# Altium schematic sheet 03-DC_DC.SchDoc
size A3
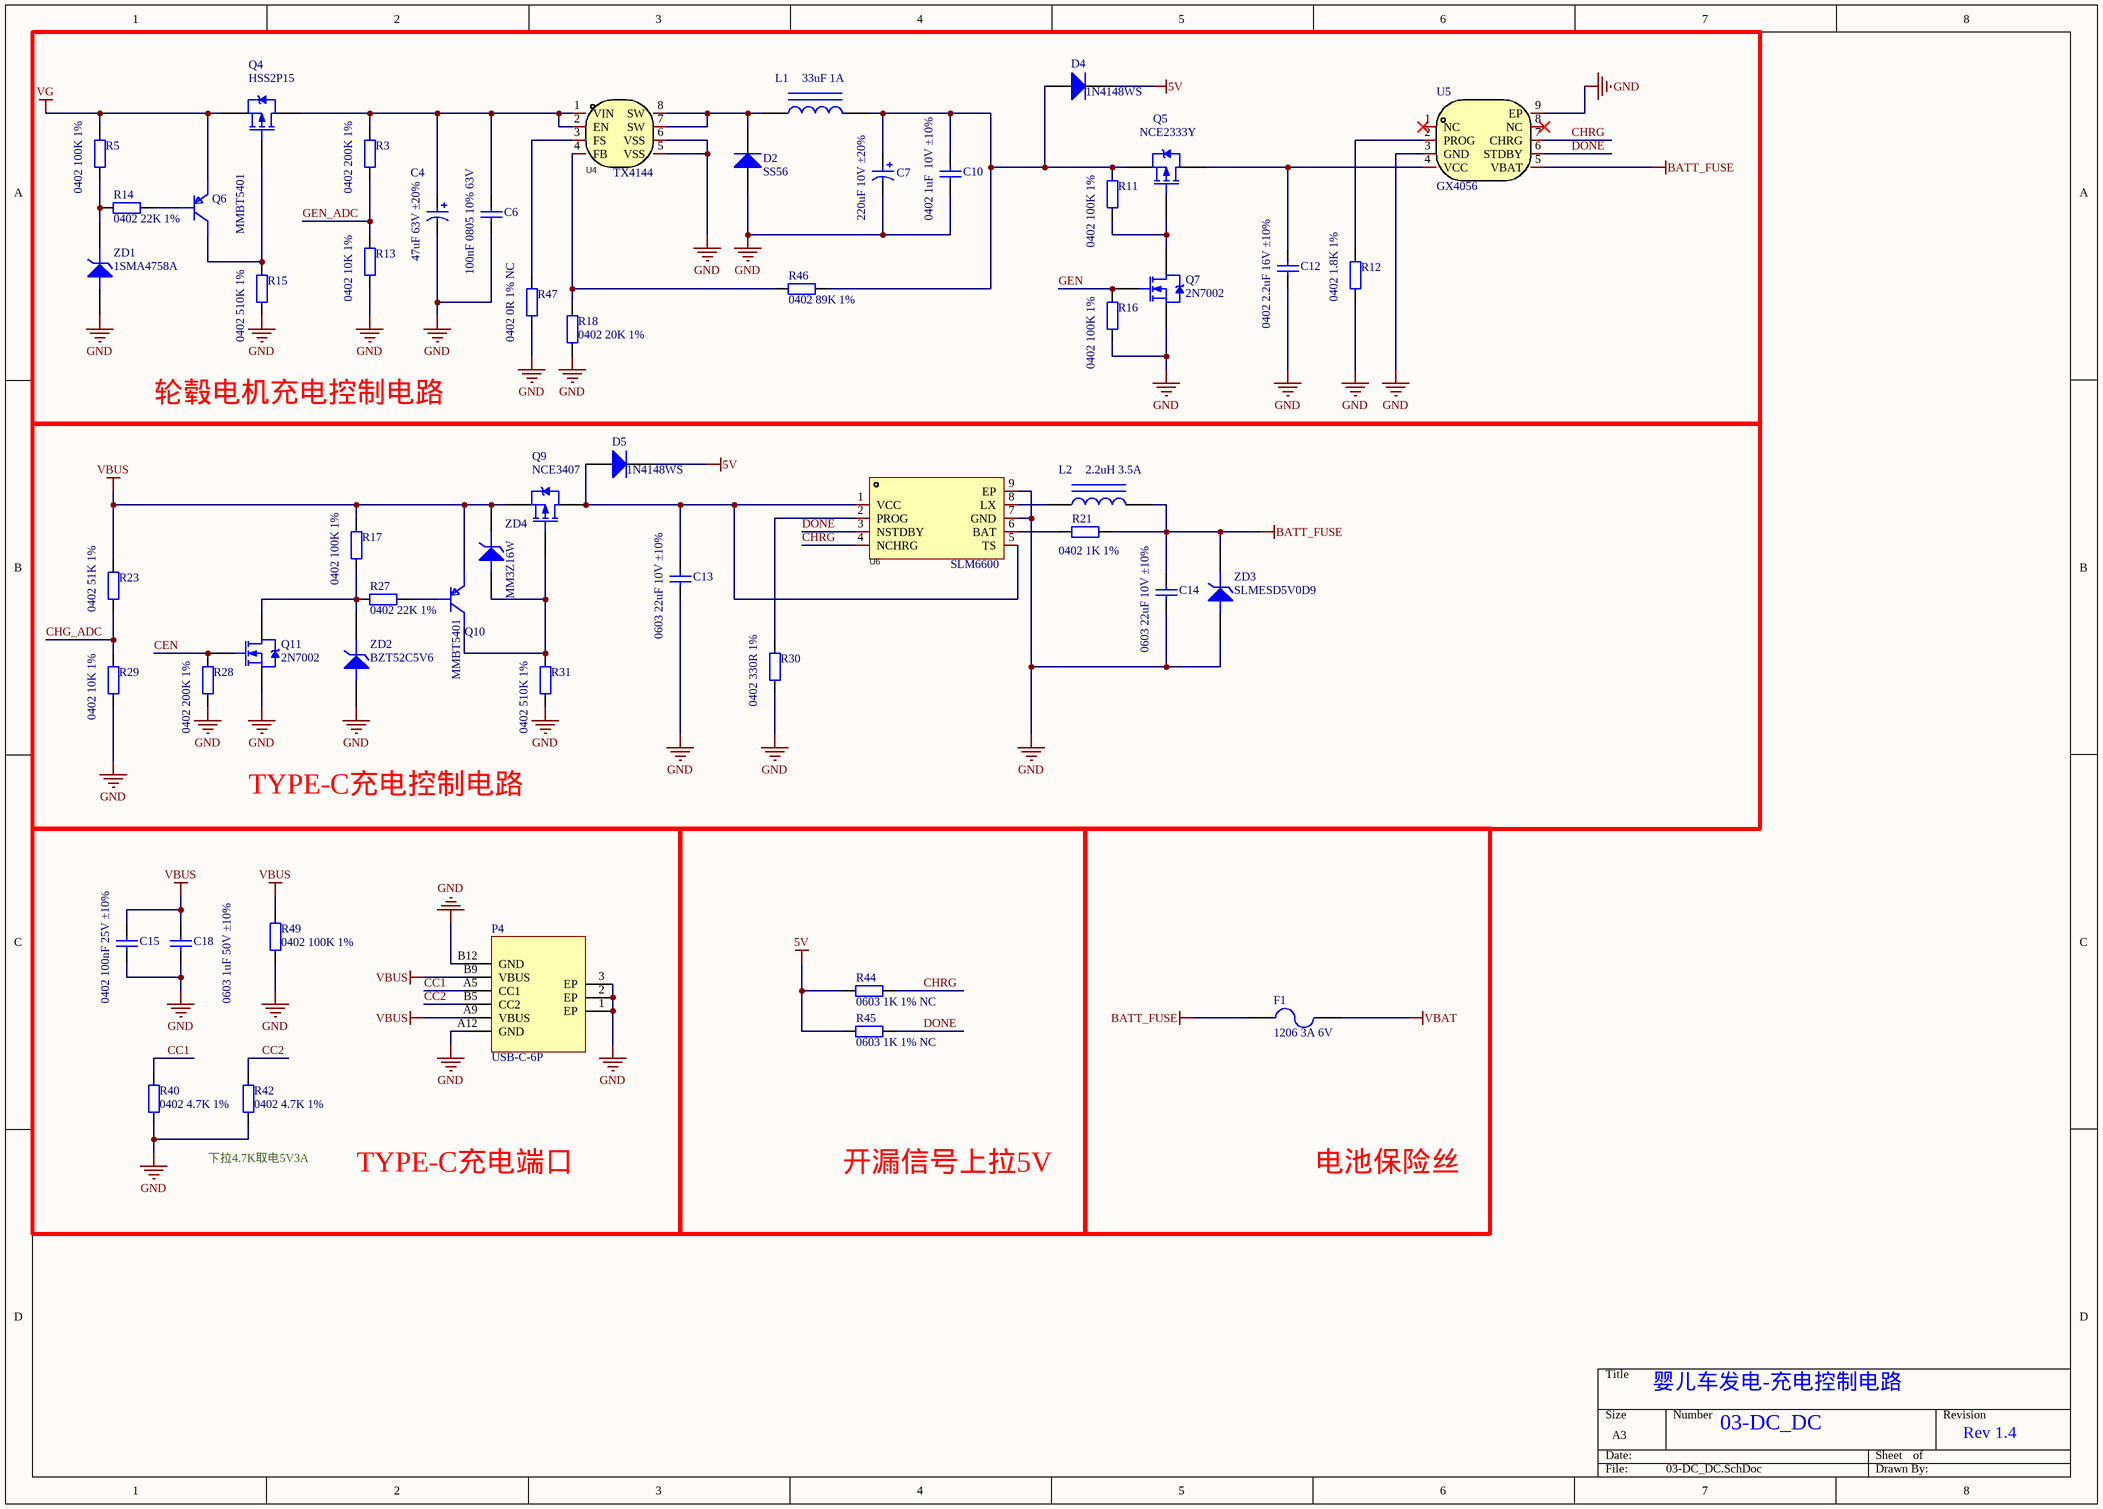
[diagram p0: 03-DC_DC.SchDoc]

## Parts
C4  47uF 63V ±20%  [CAP-TH_BD6.3-P2.50-D1.0-WD]
C6  100nF 0805 10% 63V  [0805_C]
C7  220uF 10V ±20%  [CAP-SMD_BD6.3-L6.6-W6.6-LS7.4-FD]
C10  0402 1uF  10V ±10%  [C0402]
C12  0402 2.2uF 16V ±10%  [C0402]
C13  0603 22uF 10V ±10%  [C0603]
C14  0603 22uF 10V ±10%  [C0603]
C15  0402 100nF 25V ±10%  [C0402]
C18  0603 1uF 50V ±10%  [C0603]
D2  SS56  [SMB]
D4  1N4148WS  [SOD-323F_L2.0-W1.6-LS2.5-RD]
D5  1N4148WS  [SOD-323F_L2.0-W1.6-LS2.5-RD]
F1  1206 3A 6V  [F1206]
L1  33uF 1A  [IND-SMD_L7.1-W6.6]
L2  2.2uH 3.5A  [IND2520]
P4  USB-C-6P  [USB-C-SMD_KH-TYPE-C-6P -L]
Q4  HSS2P15  [SOT-23-3-MOSFET]
Q5  NCE2333Y  [SOT-23-3-MOSFET]
Q6  MMBT5401  [SOT-23-3]
Q7  2N7002  [SOT-23-3-MOSFET]
Q9  NCE3407  [SOT-23-3-MOSFET]
Q10  MMBT5401  [SOT-23-3]
Q11  2N7002  [SOT-23-3-MOSFET]
R3  0402 200K 1%  [R0402]
R5  0402 100K 1%  [R0402]
R11  0402 100K 1%  [R0402]
R12  0402 1.8K 1%  [R0402]
R13  0402 10K 1%  [R0402]
R14  0402 22K 1%  [R0402]
R15  0402 510K 1%  [R0402]
R16  0402 100K 1%  [R0402]
R17  0402 100K 1%  [R0402]
R18  0402 20K 1%  [R0402]
R21  0402 1K 1%  [R0402]
R23  0402 51K 1%  [R0402]
R27  0402 22K 1%  [R0402]
R28  0402 200K 1%  [R0402]
R29  0402 10K 1%  [R0402]
R30  0402 330R 1%  [R0402]
R31  0402 510K 1%  [R0402]
R40  0402 4.7K 1%  [R0402]
R42  0402 4.7K 1%  [R0402]
R44  0603 1K 1% NC  [R0603]
R45  0603 1K 1% NC  [R0603]
R46  0402 89K 1%  [R0402]
R47  0402 0R 1% NC  [R0402]
R49  0402 100K 1%  [R0402]
U4  TX4144  [SOP-8_150mil]
U5  GX4056  [SOP-8-EP]
U6  SLM6600  [SOP-8_L4.9-W3.9-P1.27-LS6.0-BL-EP]
ZD1  1SMA4758A  [SMA]
ZD2  BZT52C5V6  [SOD-123]
ZD3  SLMESD5V0D9  [SOD-123]
ZD4  MM3Z16W  [SOD-323F_L2.0-W1.6-LS2.5-RD]

## Blocks framed on the sheet
TYPE-C充电端口: C15 C18 P4 R40 R42 R49
开漏信号上拉5V: R44 R45
电池保险丝: F1

## Nets
5V: D4.1(K) D5.1(K) R44.1 R45.1
BATT_FUSE: C14.2 F1.1 L2.2 R21.2 U5.5(VBAT) ZD3.1(K)
GND: C4.2 C6.1 C7.2 C10.1 C12.2 C13.1 C14.1 C15.2 C18.1 D2.2(A) P4.1(EP) P4.2(EP) P4.3(EP) P4.A12(GND) P4.B12(GND) Q7.3(S) Q11.3(S) R12.1 R13.2 R15.1 R16.1 R18.1 R28.1 R29.2 R30.2 R31.1 R40.2 R42.2 R47.1 R49.2 U4.5(VSS) U4.6(VSS) U5.3(GND) U5.9(EP) U6.7(GND) U6.9(EP) ZD1.2(A) ZD2.2(A) ZD3.2(A)
VBAT: F1.2
VBUS: C15.1 C18.2 P4.A9(VBUS) P4.B9(VBUS) Q9.3(S) Q10.2(E) R17.2 R23.2 R49.1 ZD4.1(K)
VG: Q4.3(S) Q6.2(E) R5.2
CC1: P4.A5(CC1) R40.1
CC2: P4.B5(CC2) R42.1
CEN: Q11.1(G) R28.2
CHG_ADC: R23.1 R29.1
CHRG: R44.2 U5.7(CHRG) U6.4(NCHRG)
DONE: R45.2 U5.6(STDBY) U6.3(NSTDBY)
GEN: Q7.1(G) R16.2
GEN_ADC: R3.1 R13.1
NetC4_1: C4.1 C6.2 Q4.2(D) R3.2 U4.1(VIN) U4.2(EN)
NetC7_1: C7.1 C10.2 D4.2(A) L1.2 Q5.3(S) R11.2 R46.2
NetC12_1: C12.1 Q5.2(D) U5.4(VCC)
NetC13_2: C13.2 D5.2(A) Q9.2(D) U6.1(VCC) U6.5(TS)
NetD2_1: D2.1(K) L1.1 U4.7(SW) U4.8(SW)
NetL2_1: L2.1 U6.8(LX)
NetQ4_1: Q4.1(G) Q6.3(C) R15.2
NetQ5_1: Q5.1(G) Q7.2(D) R11.1
NetQ6_1: Q6.1(B) R14.1
NetQ9_1: Q9.1(G) Q10.3(C) R31.2 ZD4.2(A)
NetQ10_1: Q10.1(B) R27.1
NetQ11_2: Q11.2(D) R17.1 R27.2 ZD2.1(K)
NetR5_1: R5.1 R14.2 ZD1.1(K)
NetR12_2: R12.2 U5.2(PROG)
NetR18_2: R18.2 R46.1 U4.4(FB)
NetR21_1: R21.1 U6.6(BAT)
NetR30_1: R30.1 U6.2(PROG)
NetR47_2: R47.2 U4.3(FS)

Not connected (* = marked no-connect by the designer): U5 1(NC)* 8(NC)*

## Notes on the sheet
- 轮毂电机充电控制电路
- TYPE-C充电控制电路
- (near R42) 下拉4.7K取电5V3A
- 婴儿车发电-充电控制电路
- 03-DC_DC
- Rev 1.4

## Library data of the parts
C4 C7 = Cap_elec: 电解电容
C6 = 0805 100nF(104) 10% 50V: 贴片电容; ComponentLink1Description: 供应商链接; ComponentLink1URL: http://www.szlcsc.com/product/details_50686.html; Package: 0805; Supplier: LC; SuppliersPartNumber: C49678
C10 C15 = Cap_0402: 贴片电容
C12-C14 C18 = Cap_0603: 贴片电容
D2 = SS56B: 贴片肖特基二极管
D4 D5 = 1N4148WS: 贴片普通二极管 Vr=100V Io=150mA Vf=1.25V
F1 = Fuse: 保险丝/熔断器
L1 L2 = Inductor Iron: 功率电感
P4 = USB-C-6P_: 6Pin USB Type-C 接口
Q4 Q5 Q9 = NCE2309: P-MOSFET with 3 Pin Vdss=60V Id=1.6A Vgs(th)=2V
Q6 Q10 = MMBT5401: PNP三极管
Q7 Q11 = 2N7002: N-MOSFET with 3 Pin Vdss=60V  Id=115mA Vgs(th)=2.5V
R3 R5 R11 R12 R14-R18 R21 R27 R28 R30 R31 R40 R42 R46 R47 R49 = Res_0402: 贴片电阻
R13 R23 R29 R44 R45 = Res_0603: 贴片电阻
U4 = TX4144: 降压型 输入6V~60V 1.5A; Manufacturer: XDS(芯鼎盛); Add into BOM: yes; Number of Outputs: 1; Input Voltage: 6V~0V; Switching Frequency: 140kHz；450kHz; Quiescent Current (Iq): 150uA; Name: TX4144; Symbol: TX4144; Device: TX4144; LCSC Part Name: 降压型 Vin=6V~0V 1.5A; Supplier Part: C4153685; Manufacturer Part: TX4144; Supplier Footprint: SOP-8; JLCPCB Part Class: Extended Part; Datasheet: https://atta.szlcsc.com/upload/public/pdf/source/20220706/F01FB6E18B2A790E98A19A1C52DE2D08.pdf; Supplier: LCSC; Convert to PCB: yes; Function: 降压型; Synchronous Rectification: -; Output Type: -; Topology: -; Output Voltage: -; Output Current (Max): 1.5A; Operating Temperature: -40℃~+85℃@(Ta)
U5 = GX4056: 1000mA 锂电池充电器芯片; Manufacturer: 国芯佳品; Add into BOM: yes; Maximum Charge Current: 1A; Name: GX4056; Symbol: GX4056; Device: GX4056; LCSC Part Name: GX4056; Supplier Part: C5259236; Manufacturer Part: GX4056; Supplier Footprint: SOP-8-EP; JLCPCB Part Class: Extended Part; Datasheet: https://atta.szlcsc.com/upload/public/pdf/source/20221111/1186739FA5174D5673D9C2FF440403FD.pdf; Supplier: LCSC; Convert to PCB: yes
U6 = SLM6600: 锂电池管理; Manufacturer: 无锡松朗微; Add into BOM: yes; Name: SLM6600; Symbol: SLM6600; Device: SLM6600; LCSC Part Name: SLM6600; Supplier Part: C130316; Manufacturer Part: SLM6600; Supplier Footprint: SOP-8-EP-150mil; JLCPCB Part Class: Extended Part; Datasheet: https://atta.szlcsc.com/upload/public/pdf/source/20200723/C130316_33CFDDBAEF8892C90734B89DFA84F834.pdf; Supplier: LCSC; Convert to PCB: yes
ZD1-ZD4 = ZENER/TVS: 稳压管/单向TVS管
  ZD1: link: https://item.szlcsc.com/436890.html